# EAGLE schematic Schematic (EAGLE 9.6.2)
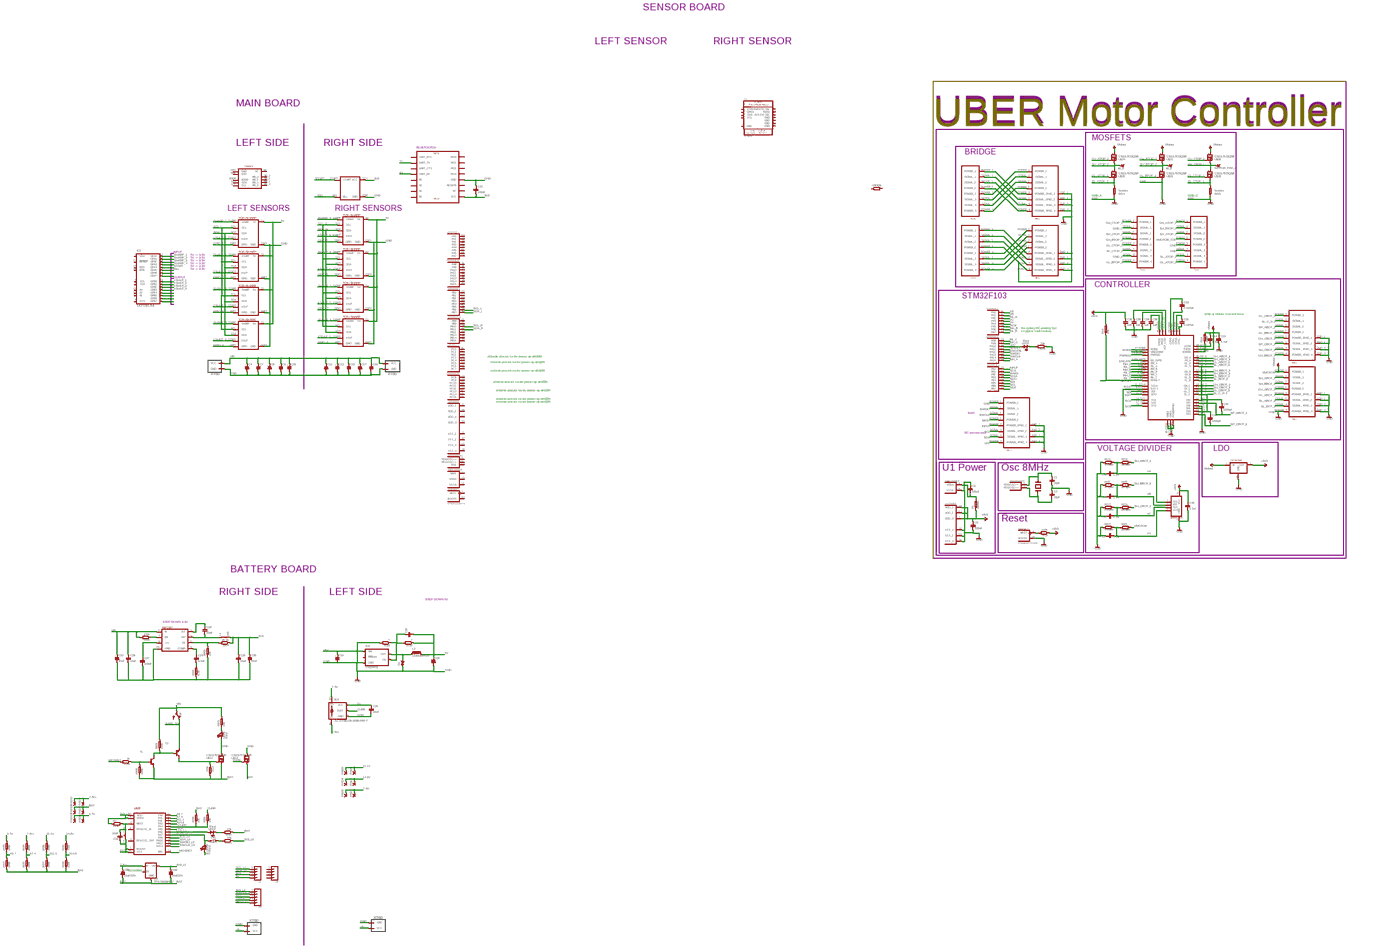
[diagram p0: schematic, sheet 1, overview]
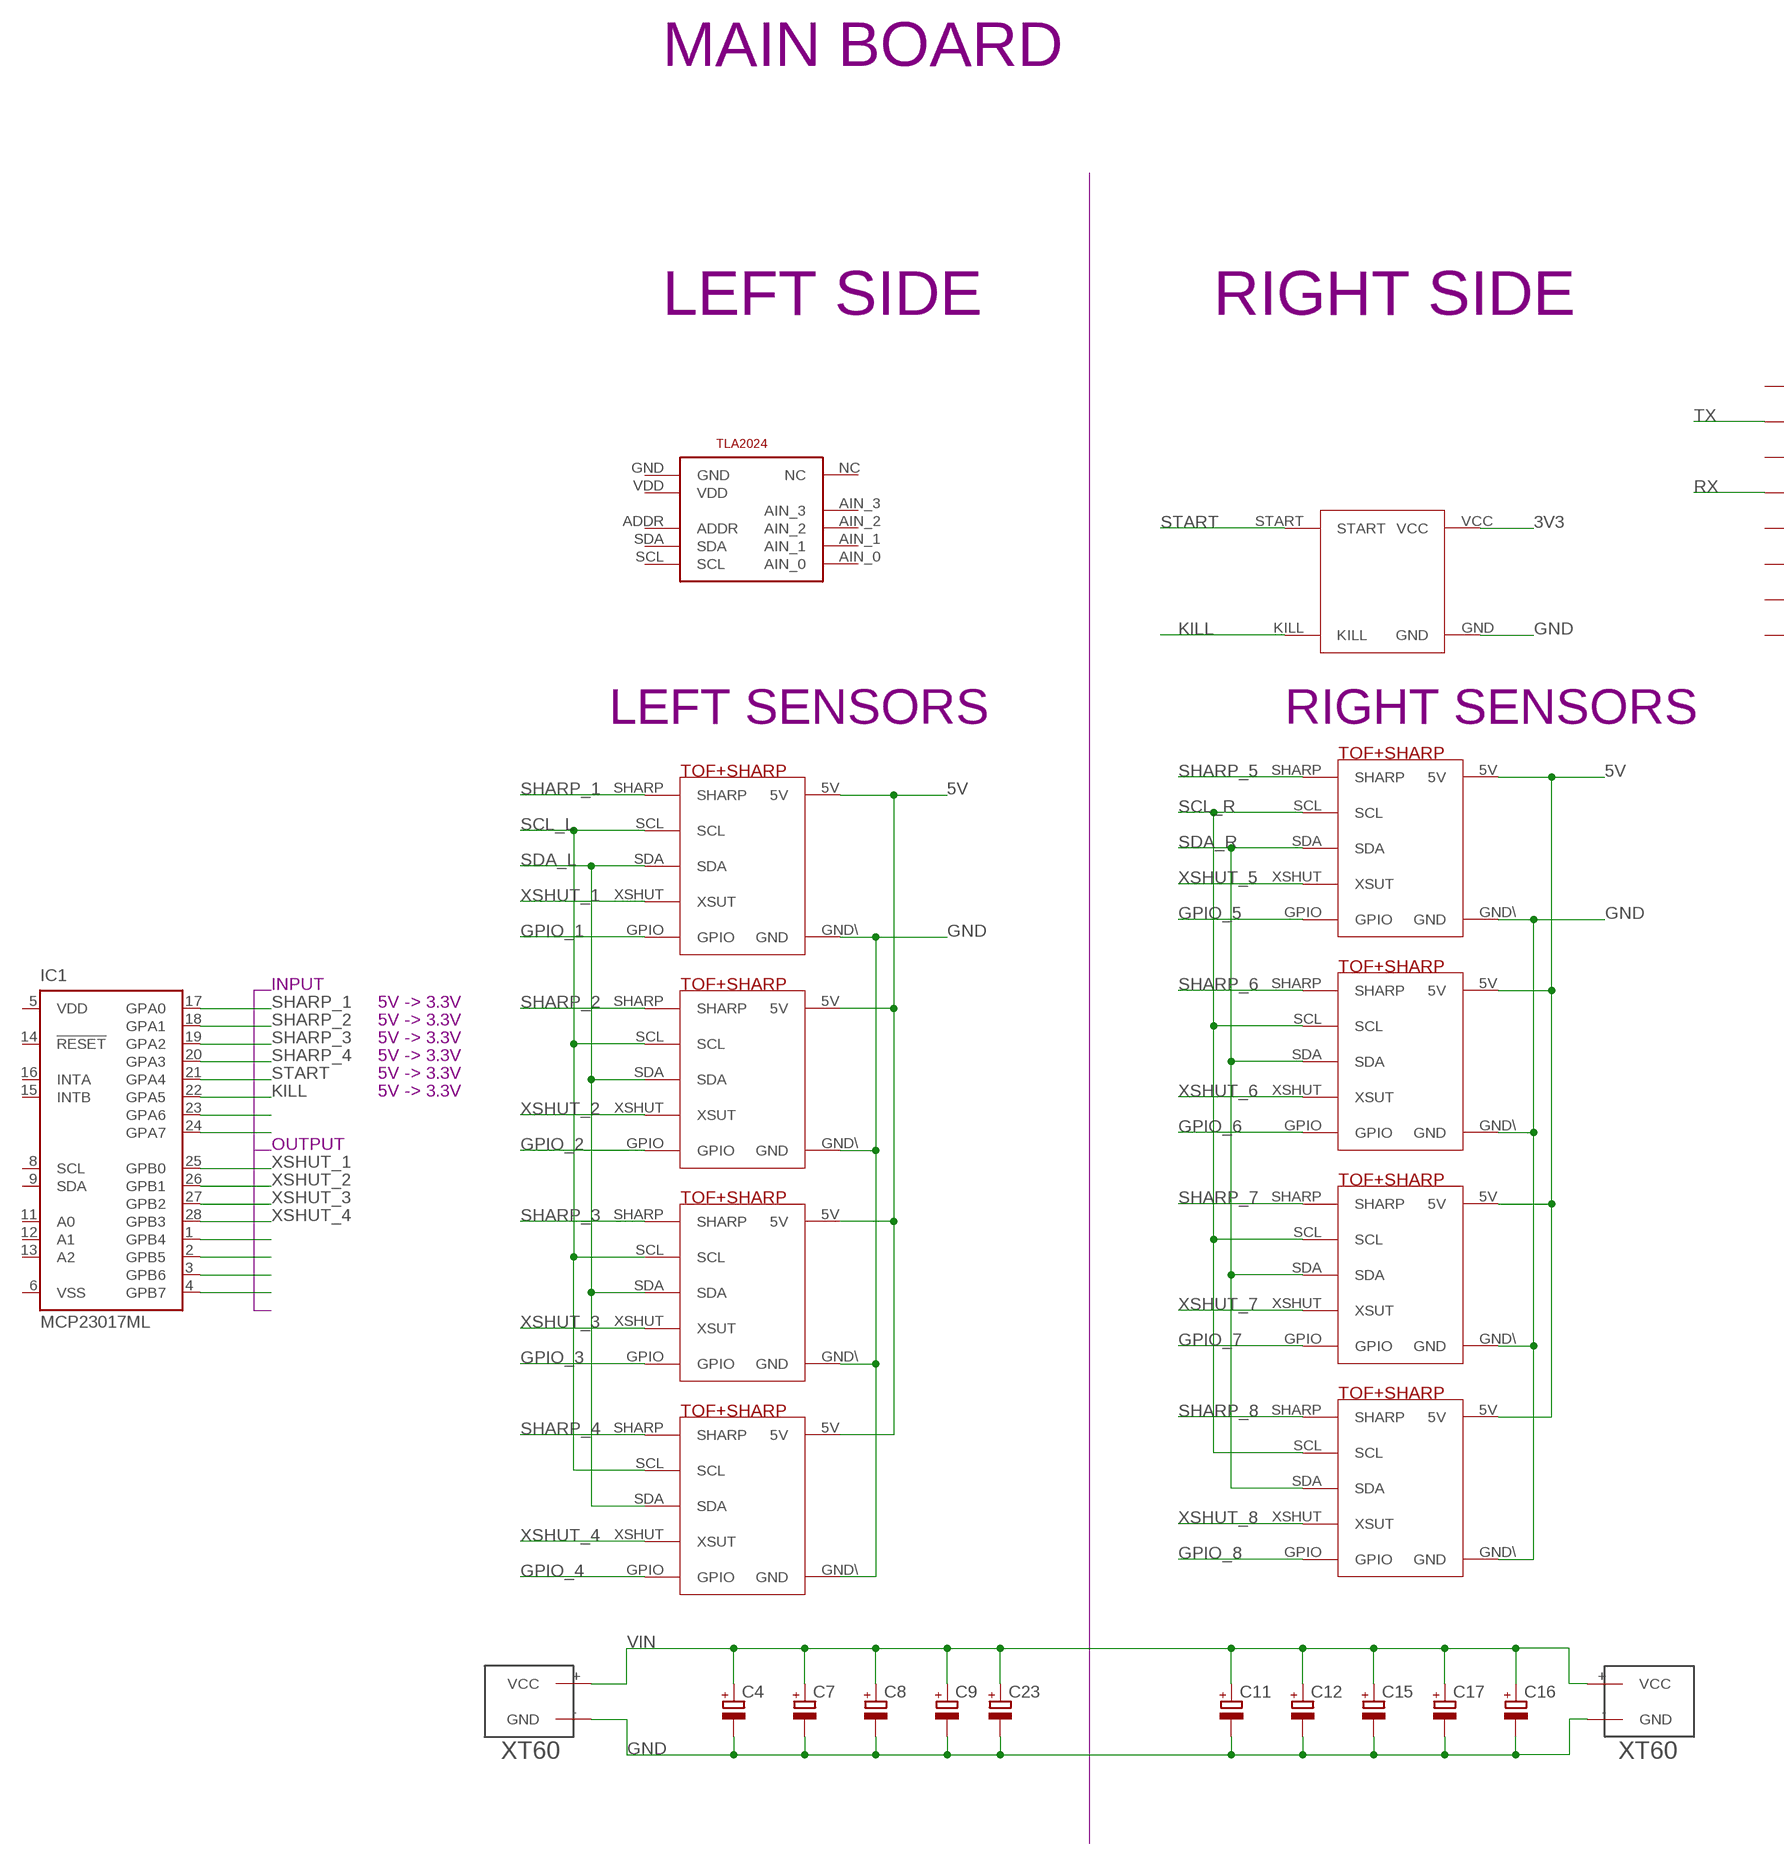
[diagram p1: schematic, sheet 1, part 1 of 5]
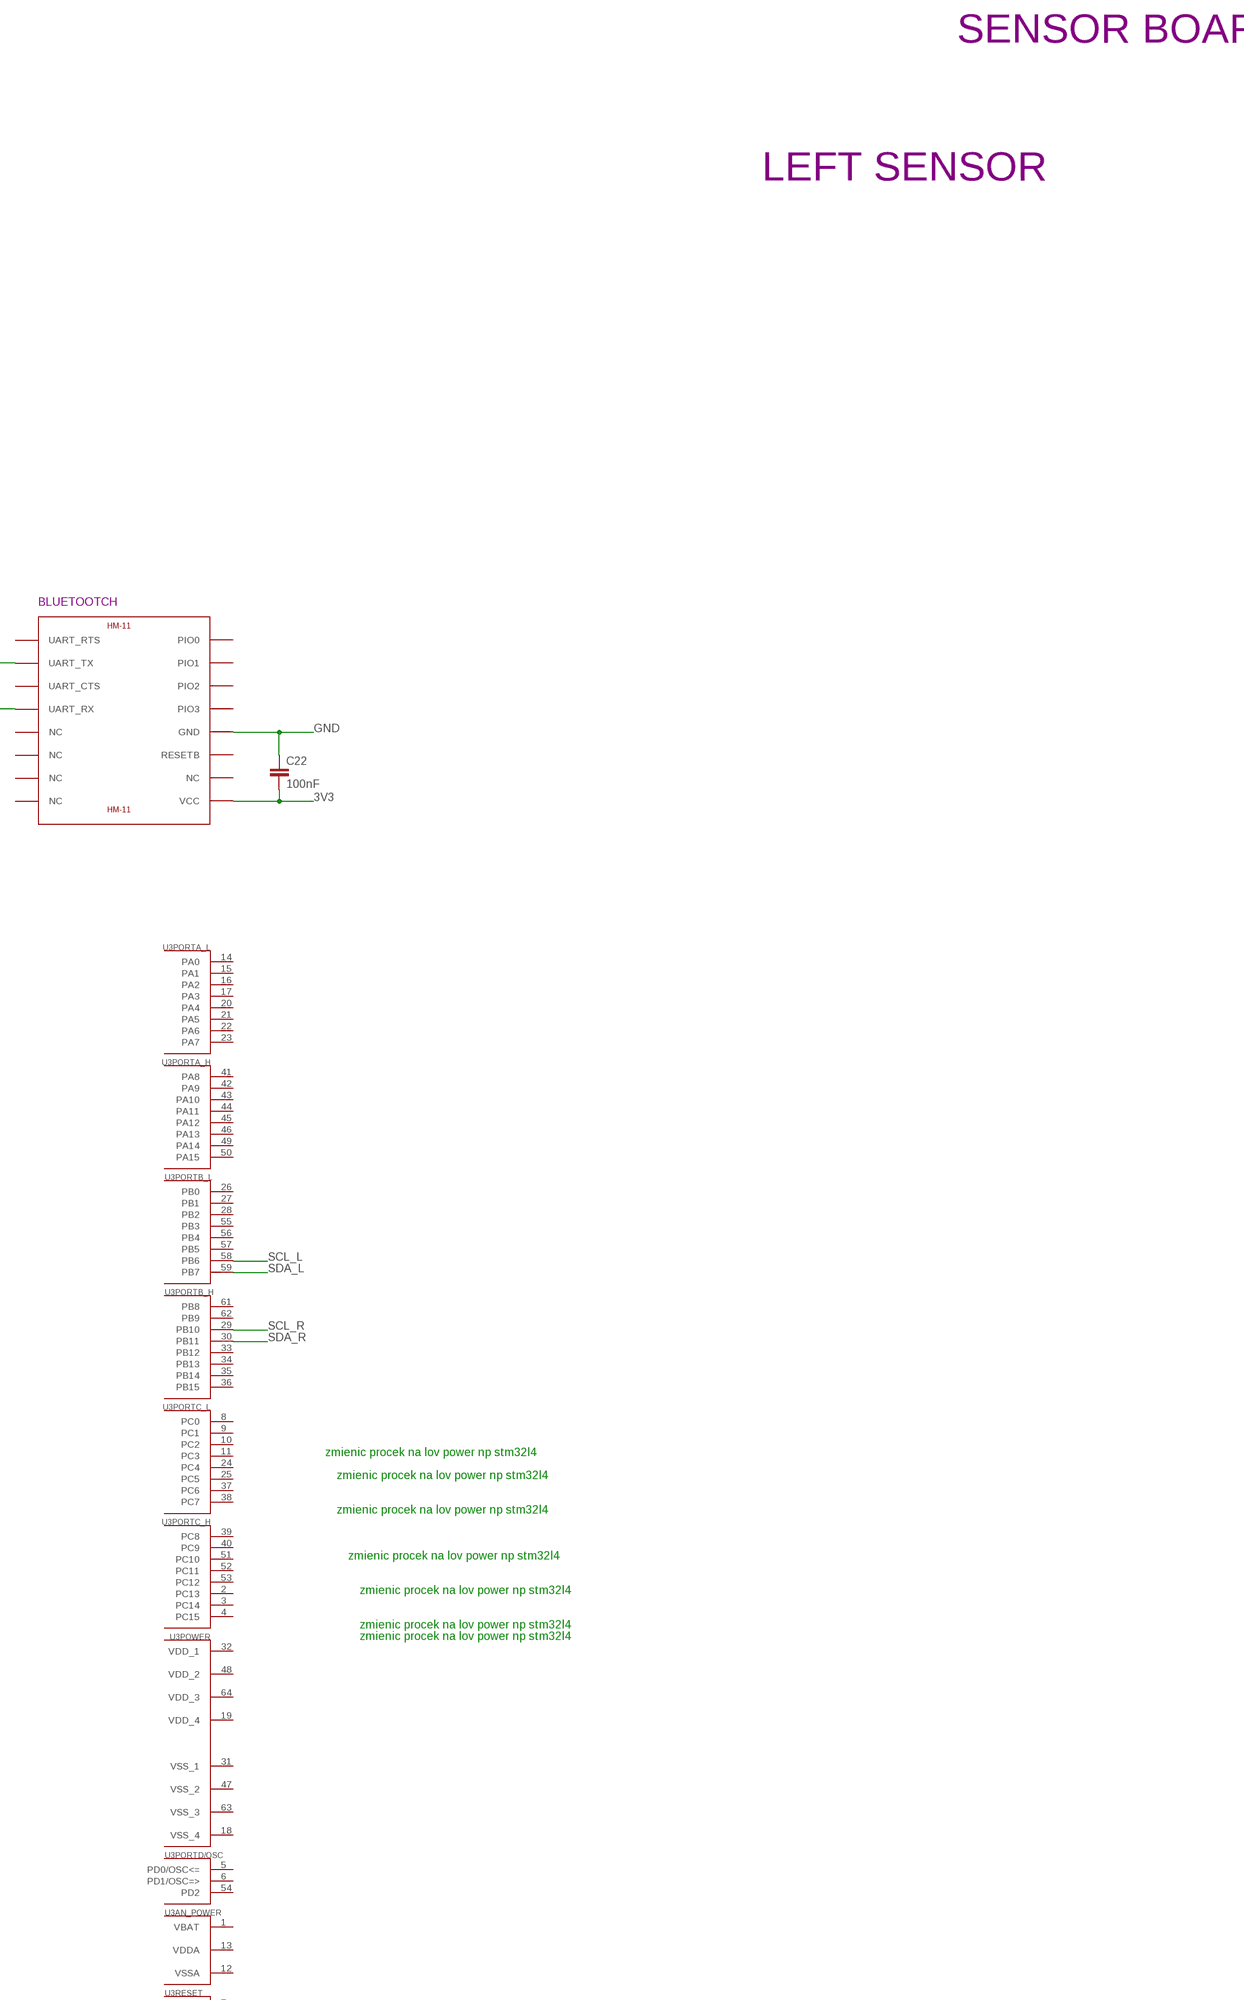
[diagram p2: schematic, sheet 1, part 2 of 5]
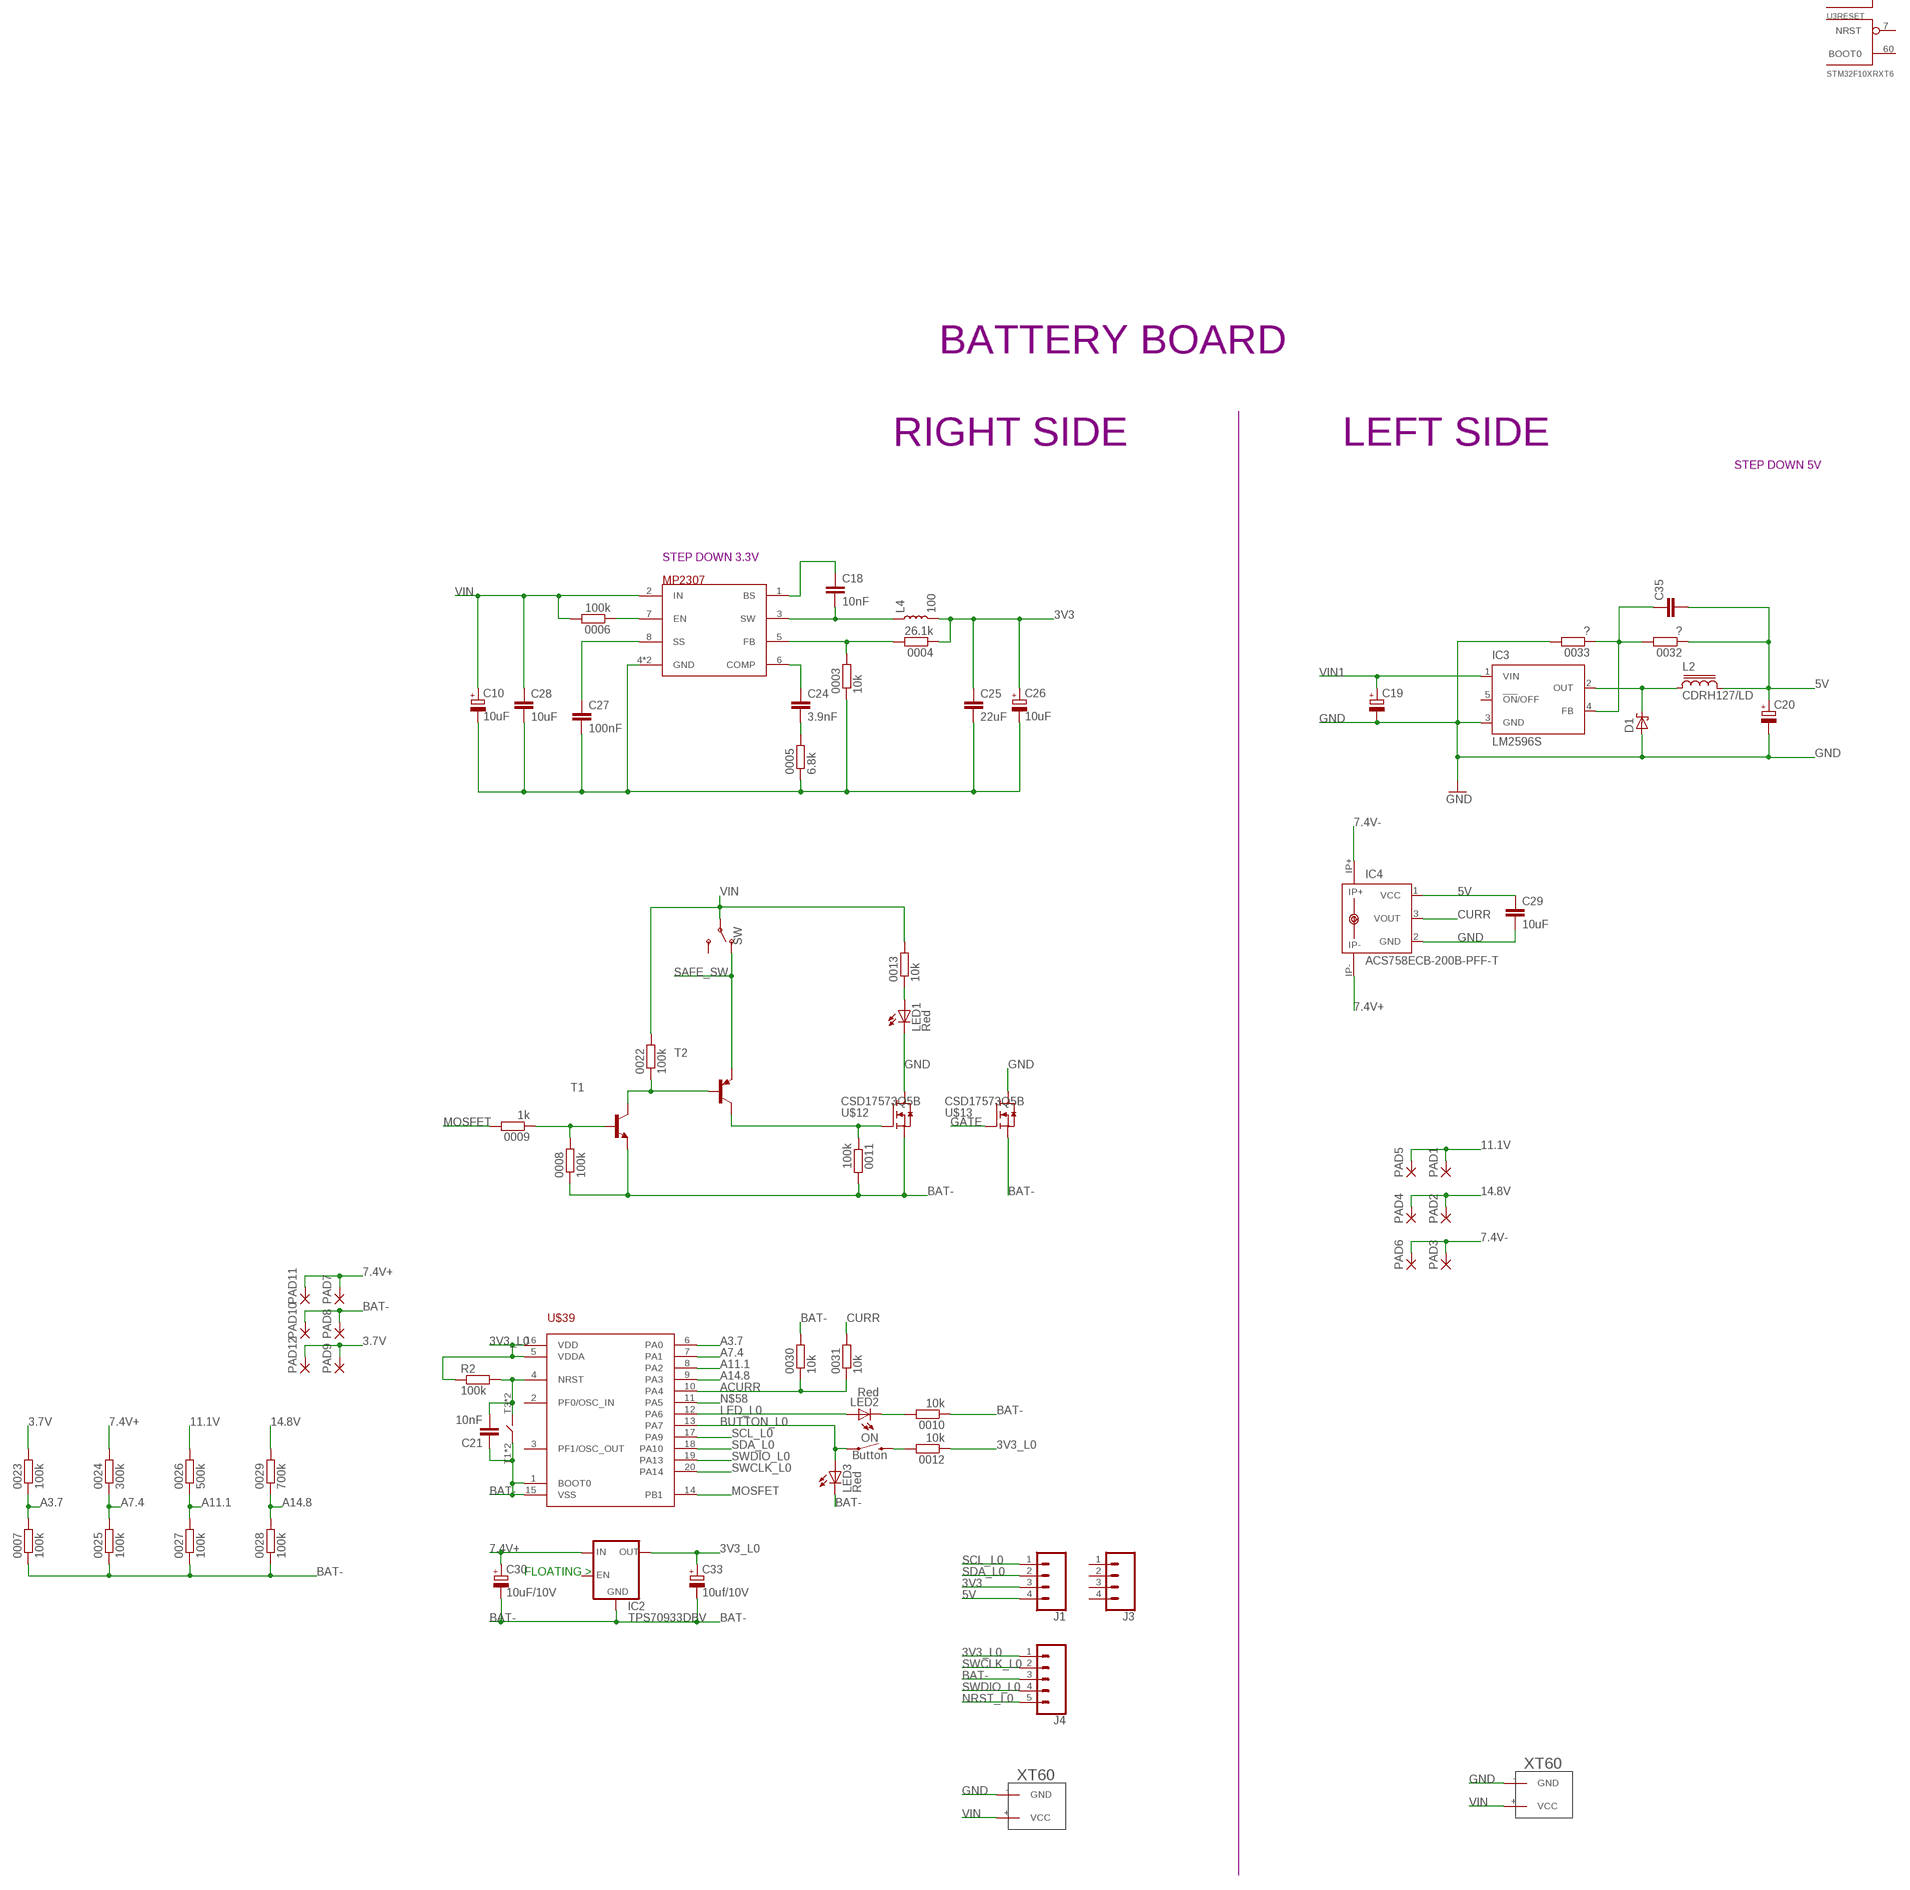
[diagram p3: schematic, sheet 1, part 3 of 5]
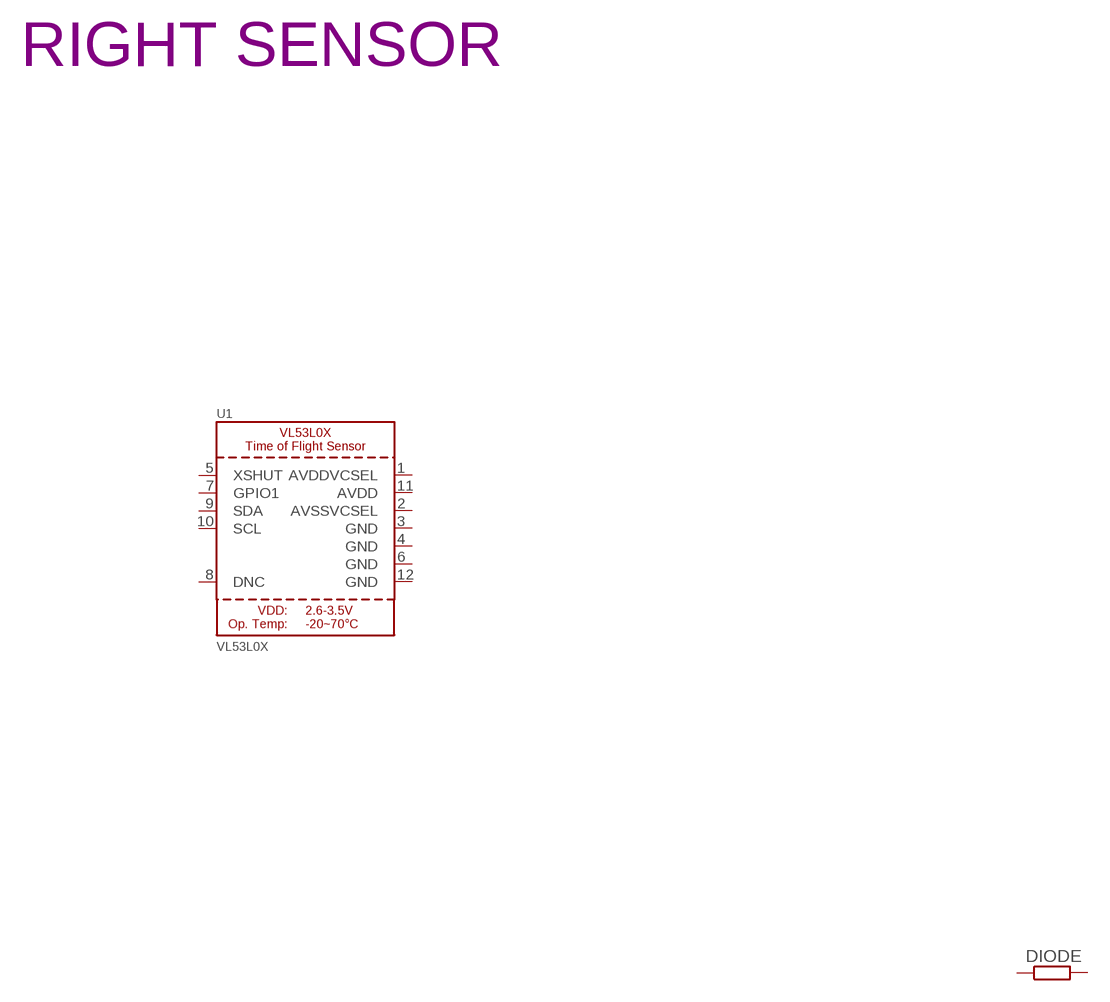
[diagram p4: schematic, sheet 1, part 4 of 5]
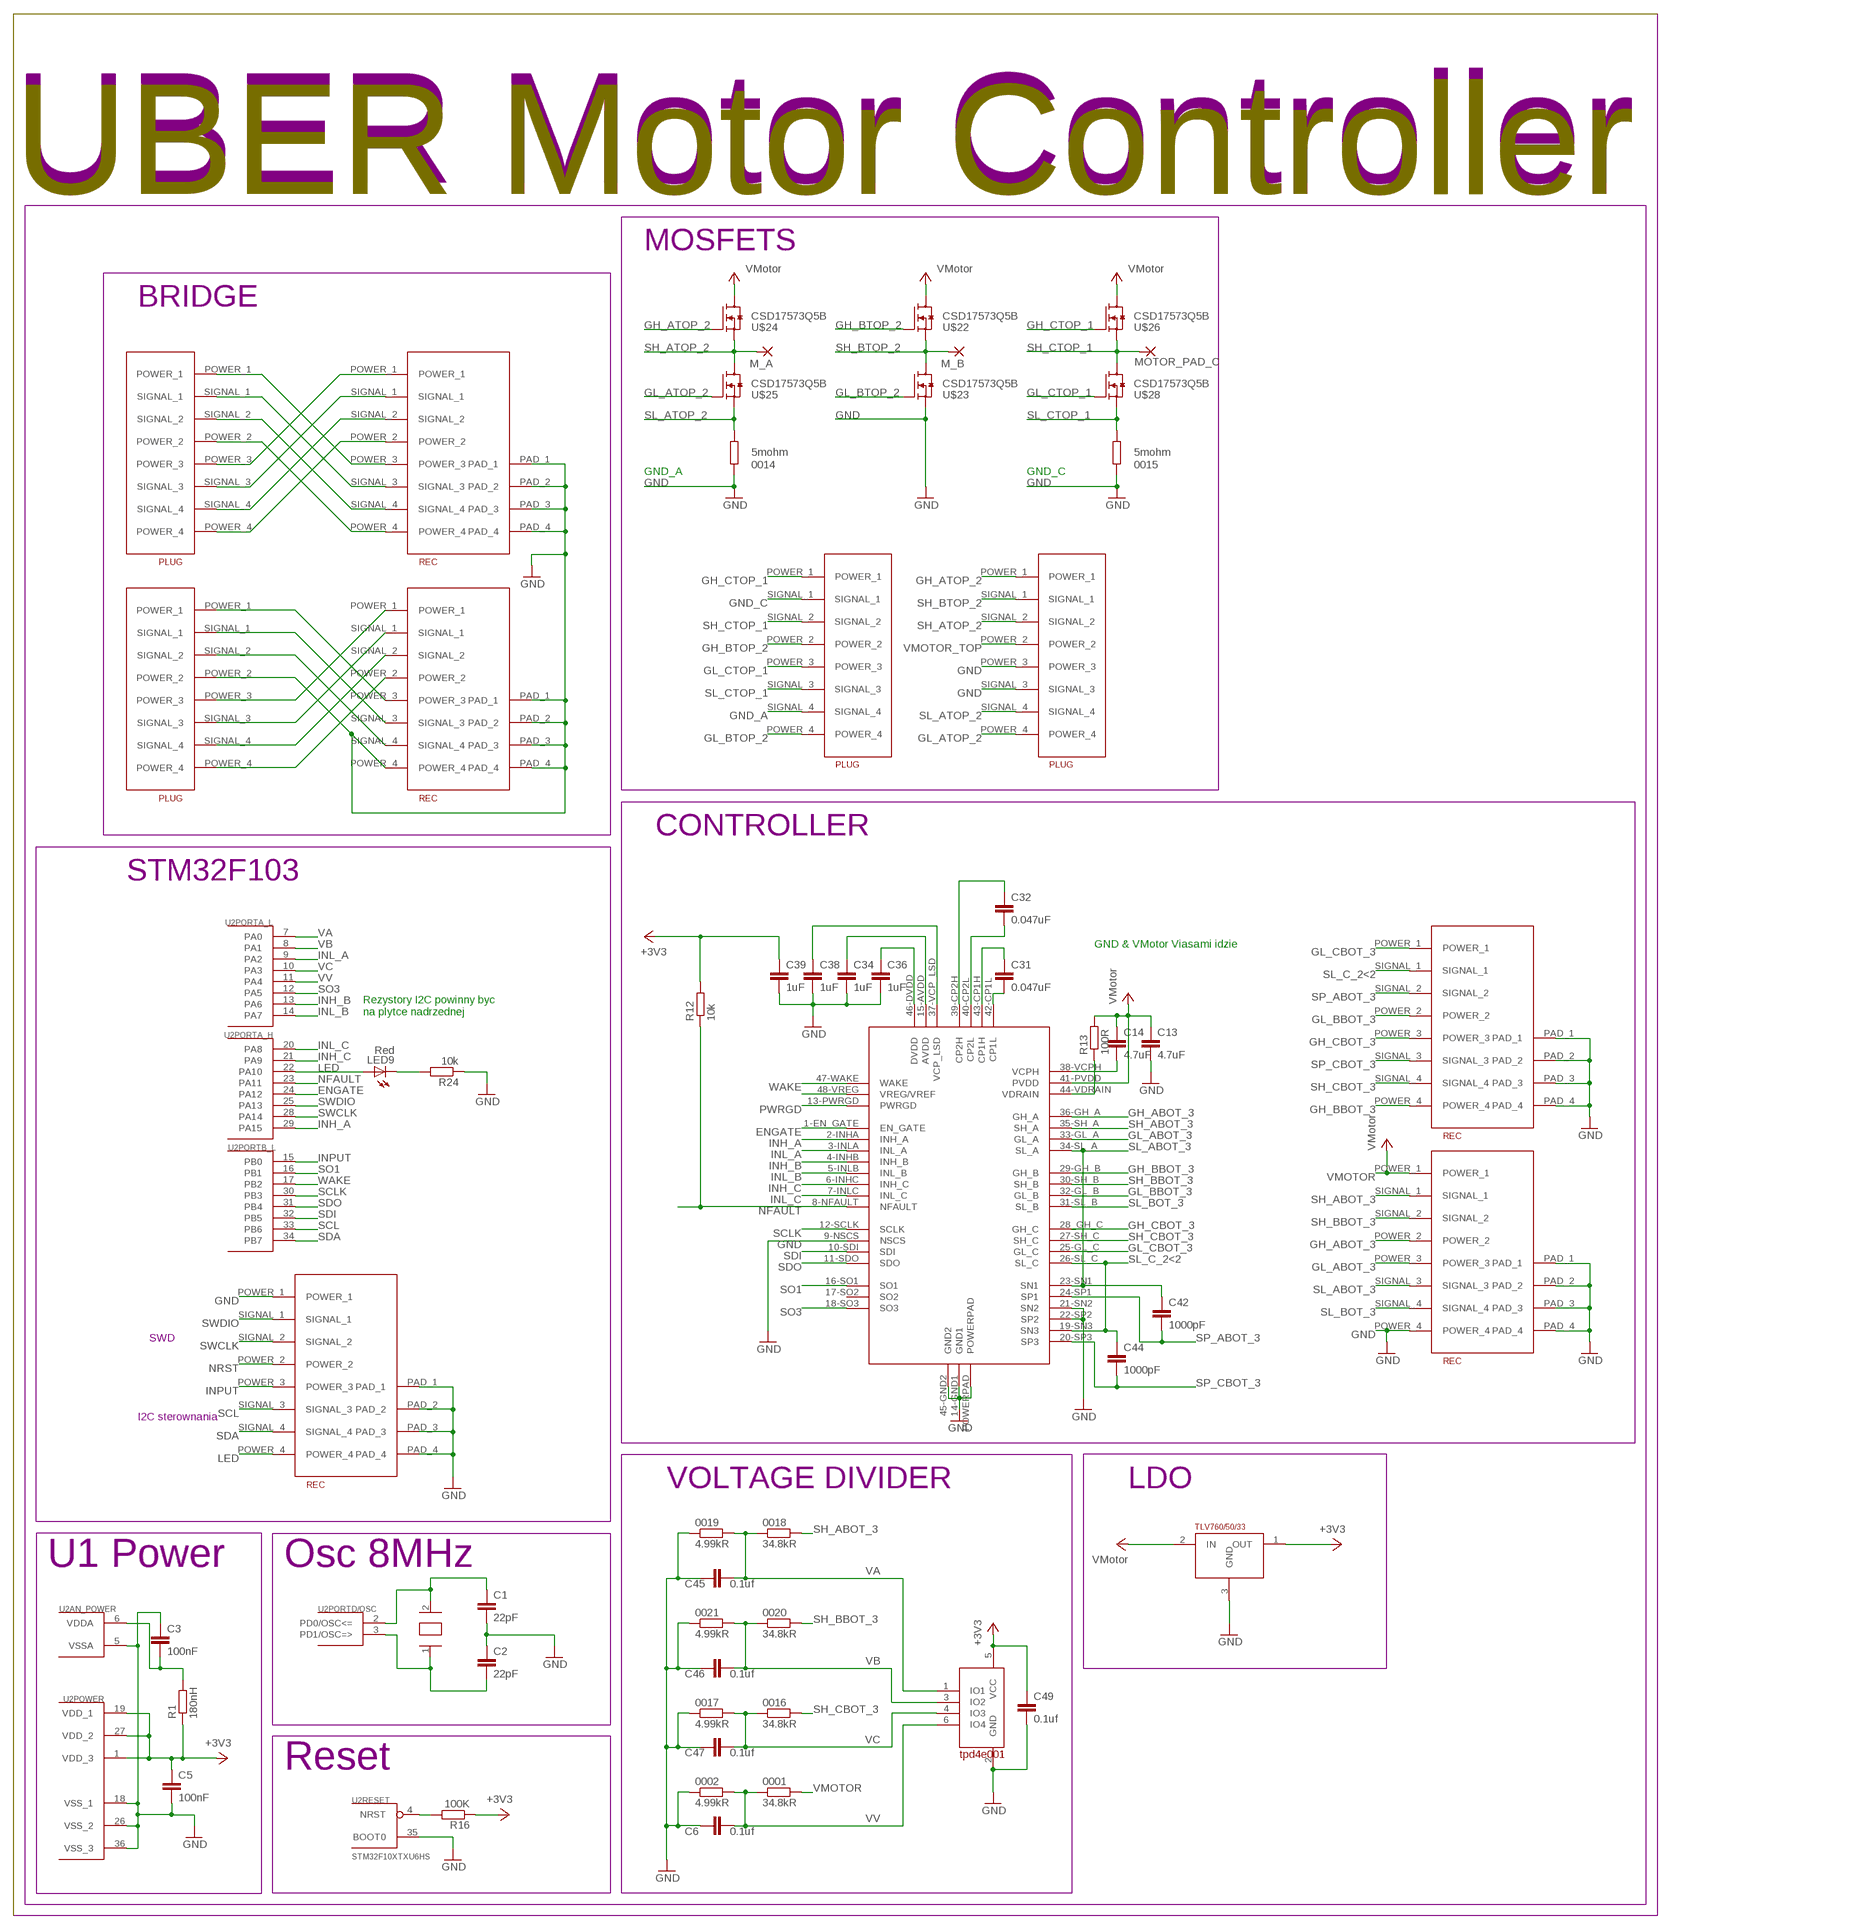
[diagram p5: schematic, sheet 1, part 5 of 5]

## Parts
0001  34.8kR  R-EU_R0603  [R0603]
0002  4.99kR  R-EU_R0603  [R0603]
0003  10k  R-EU_R0603  [R0603]
0004  26.1k  R-EU_R0603  [R0603]
0005  6.8k  R-EU_R0603  [R0603]
0006  100k  R-EU_R0603  [R0603]
0007  100k  R-EU_R0603  [R0603]
0008  100k  R-EU_R0603  [R0603]
0009  1k  R-EU_R0603  [R0603]
0010  10k  R-EU_R0603  [R0603]
0011  100k  R-EU_R0603  [R0603]
0012  10k  R-EU_R0603  [R0603]
0013  10k  R-EU_R0603  [R0603]
0014  5mohm  R-EU_R2512  [R2512]
0015  5mohm  R-EU_R2512  [R2512]
0016  34.8kR  R-EU_R0603  [R0603]
0017  4.99kR  R-EU_R0603  [R0603]
0018  34.8kR  R-EU_R0603  [R0603]
0019  4.99kR  R-EU_R0603  [R0603]
0020  34.8kR  R-EU_R0603  [R0603]
0021  4.99kR  R-EU_R0603  [R0603]
0022  100k  R-EU_R0603  [R0603]
0023  100k  R-EU_R0603  [R0603]
0024  300k  R-EU_R0603  [R0603]
0025  100k  R-EU_R0603  [R0603]
0026  500k  R-EU_R0603  [R0603]
0027  100k  R-EU_R0603  [R0603]
0028  100k  R-EU_R0603  [R0603]
0029  700k  R-EU_R0603  [R0603]
0030  10k  R-EU_R0603  [R0603]
0031  10k  R-EU_R0603  [R0603]
0032  ?  R-EU_R0603  [R0603]
0033  ?  R-EU_R0603  [R0603]
C1  22pF  C-EUC0603  [C0603]
C2  22pF  C-EUC0603  [C0603]
C3  100nF  C-EUC0603  [C0603]
C4  CPOL-EU153CLV-0810  [153CLV-0810]
C5  100nF  C-EUC0603  [C0603]
C6  0.1uf  C-EUC0603  [C0603]
C7  CPOL-EU153CLV-0810  [153CLV-0810]
C8  CPOL-EU153CLV-0810  [153CLV-0810]
C9  CPOL-EU153CLV-0810  [153CLV-0810]
C10  10uF  CPOL-EU153CLV-0605  [153CLV-0605]
C11  CPOL-EU153CLV-0810  [153CLV-0810]
C12  CPOL-EU153CLV-0810  [153CLV-0810]
C13  4.7uF  C-EUC0805  [C0805]
C14  4.7uF  C-EUC0805  [C0805]
C15  CPOL-EU153CLV-0810  [153CLV-0810]
C16  CPOL-EU153CLV-0810  [153CLV-0810]
C17  CPOL-EU153CLV-0810  [153CLV-0810]
C18  10nF  C-EUC0603  [C0603]
C19  CPOL-EU153CLV-0810  [153CLV-0810]
C20  CPOL-EU153CLV-0810  [153CLV-0810]
C21  10nF  C-EUC0603  [C0603]
C22  100nF  C-EUC0603  [C0603]
C23  CPOL-EU153CLV-0810  [153CLV-0810]
C24  3.9nF  C-EUC0603  [C0603]
C25  22uF  C-EUC0805  [C0805]
C26  10uF  CPOL-EU153CLV-0605  [153CLV-0605]
C27  100nF  C-EUC0603  [C0603]
C28  10uF  C-EUC0805  [C0805]
C29  10uF  C-EUC0805  [C0805]
C30  10uF/10V  CPOL-EUSMCA  [SMC_A]
C31  0.047uF  C-EUC0603  [C0603]
C32  0.047uF  C-EUC0603  [C0603]
C33  10uf/10V  CPOL-EUSMCA  [SMC_A]
C34  1uF  C-EUC0603  [C0603]
C35  C-EUC0603  [C0603]
C36  1uF  C-EUC0603  [C0603]
C38  1uF  C-EUC0603  [C0603]
C39  1uF  C-EUC0603  [C0603]
C42  1000pF  C-EUC0603  [C0603]
C44  1000pF  C-EUC0603  [C0603]
C45  0.1uf  C-EUC0603  [C0603]
C46  0.1uf  C-EUC0603  [C0603]
C47  0.1uf  C-EUC0603  [C0603]
C49  0.1uf  C-EUC0603  [C0603]
D1  SCHOTTKY-DIODESMD  [SMB]
DIODE  R-EU_R0805  [R0805]
IC1  MCP23017ML  [QFN28-ML_6X6MM]
IC2  TPS70933DBV  [SOT23-5]
IC3  LM2596S  [TO263-5]
IC4  ACS758ECB-200B-PFF-T  [CB-PFF]
J1  CONN_04  [1X04]
J3  CONN_04  [1X04]
J4  CONN_05  [1X05]
L2  CDRH127/LD  [CDRH127/LD]
L4  100  INDUCTOR-SRN6045-33UH  [SRN6045]
LED1  Red  LEDSML0603  [SML0603]
LED2  Red  LEDSML0603  [SML0603]
LED3  Red  LEDSML0603  [SML0603]
LED9  Red  LEDSML0603  [SML0603]
M_A  SMD5  [SMD2,54-5,08]
M_B  SMD5  [SMD2,54-5,08]
MOTOR_PAD_C  SMD5  [SMD2,54-5,08]
ON  Button  MOMENTARY-SWITCH-SPST-SMD-RIGHT-ANGLE  [TACTILE_SWITCH_SMD_RIGHT_ANGLE]
PAD1  SMD5  [SMD2,54-5,08]
PAD2  SMD5  [SMD2,54-5,08]
PAD3  SMD5  [SMD2,54-5,08]
PAD4  SMD5  [SMD2,54-5,08]
PAD5  SMD5  [SMD2,54-5,08]
PAD6  SMD5  [SMD2,54-5,08]
PAD7  SMD5  [SMD2,54-5,08]
PAD8  SMD5  [SMD2,54-5,08]
PAD9  SMD5  [SMD2,54-5,08]
PAD10  SMD5  [SMD2,54-5,08]
PAD11  SMD5  [SMD2,54-5,08]
PAD12  SMD5  [SMD2,54-5,08]
R1  180nH  R-EU_R0603  [R0603]
R2  100k  R-EU_R0603  [R0603]
R12  10k  R-EU_R0603  [R0603]
R13  100R  R-EU_R0603  [R0603]
R16  100K  R-EU_R0603  [R0603]
R24  10k  R-EU_R0603  [R0603]
SW  SWITCH-SPDT-SMD-RIGHT-ANGLE  [SWITCH_SPST_SMD_A]
T1  BC817-25-NPN-SOT23-BEC  [SOT23-BEC]
T2  BC807-40-PNP-SOT23-BEC  [SOT23-BEC]
U1  VL53L0X  [LGA12_ST]
U2  STM32F10XTXU6HS  [VFQFPN36-HS]
U3  STM32F10XRXT6  [TQFP64]
U$1  MOLEG_REC_8X0.4MM  [REC]
U$2  MOLEG_REC_8X0.4MM  [REC]
U$3  MOLEX_PLUG_8X0.4MM  [PLUG]
U$4  MOLEG_REC_8X0.4MM  [REC]
U$5  MOLEG_REC_8X0.4MM  [REC]
U$6  MOLEX_PLUG_8X0.4MM  [PLUG]
U$7  MOLEX_PLUG_8X0.4MM  [PLUG]
U$8  MOLEX_PLUG_8X0.4MM  [PLUG]
U$9  MOLEG_REC_8X0.4MM  [REC]
U$10  OSC_8MHZ  [SMD_MINI]
U$11  TLV760XX  [SOT-23-3]
U$12  CSD17573Q5B  [Q5B]
U$13  CSD17573Q5B  [Q5B]
U$14  TOF+SHARP  [TOF+SHARP_V1]
U$15  TOF+SHARP  [TOF+SHARP_V1]
U$16  TOF+SHARP  [TOF+SHARP_V1]
U$17  XT60  [XT60]
U$18  TOF+SHARP  [TOF+SHARP_V1]
U$19  TOF-SHARP  [TOF+SHARP_V2]
U$20  TOF-SHARP  [TOF+SHARP_V2]
U$21  DRV8305  [S-PQFP-G48]
U$22  CSD17573Q5B  [Q5B]
U$23  CSD17573Q5B  [Q5B]
U$24  CSD17573Q5B  [Q5B]
U$25  CSD17573Q5B  [Q5B]
U$26  CSD17573Q5B  [Q5B]
U$27  TOF-SHARP  [TOF+SHARP_V2]
U$28  CSD17573Q5B  [Q5B]
U$29  TOF-SHARP  [TOF+SHARP_V2]
U$30  SUPER_DUPER_GUZICZEK  [SUPER_DUPER_GUZICZEK]
U$31  TPD4E001  [SOT-23]
U$32  IR_SW  [IR_SW]
U$33  TLA2024  [X2QFN]
U$34  HM-11  [HM-11]
U$35  MP2307  [SOIC8N]
U$36  XT60  [XT60]
U$37  XT60  [XT60]
U$38  XT60  [XT60]
U$39  STM32F030F4  [TSSOP20]

## Nets
3.7V: 0023.2 PAD9.1(P) PAD12.1(P)
3V3: 0004.1 C22.2 C25.1 C26.+ J1.3 L4.2 U$32.VCC U$34.VCC
3V3_L0: 0012.1 C33.+ IC2.5(OUT) J4.1 R2.1 U$39.5(VDDA) U$39.16(VDD)
5V: 0032.1 C20.+ C29.1 C35.2 IC4.1(VCC) J1.4 L2.2 U$14.5V U$15.5V U$16.5V U$18.5V U$19.5V U$20.5V U$27.5V U$29.5V
7.4V+: 0024.2 C30.+ IC2.1(IN) IC4.IP- PAD7.1(P) PAD11.1(P)
7.4V-: IC4.IP+ PAD3.1(P) PAD6.1(P)
11.1V: 0026.2 PAD1.1(P) PAD5.1(P)
14.8V: 0029.2 PAD2.1(P) PAD4.1(P)
+3V3: C5.1 C39.1 C49.1 R1.1 R12.2 R16.1 U2.1(POWER:VDD_3) U2.19(POWER:VDD_1) U2.27(POWER:VDD_2) U$11.1(OUT) U$31.5(VCC)
A3.7: 0007.2 0023.1 U$39.6(PA0)
A7.4: 0024.1 0025.2 U$39.7(PA1)
A11.1: 0026.1 0027.2 U$39.8(PA2)
A14.8: 0028.2 0029.1 U$39.9(PA3)
ACURR: 0030.1 0031.1 U$39.10(PA4)
BAT-: 0007.1 0008.1 0010.1 0011.2 0025.1 0027.1 0028.1 0030.2 C21.1 C30.- C33.- IC2.2(GND) J4.3 LED3.C PAD8.1(P) PAD10.1(P) T1.E U$12.S1(S) U$12.S2(S) U$12.S3(S) U$13.S1(S) U$13.S2(S) U$13.S3(S) U$30.T1(T2) U$30.T2 U$39.1(BOOT0) U$39.15(VSS)
BS: C18.1 U$35.1(BS)
BUTTON_L0: LED3.A ON.1 U$39.13(PA7)
COMP: C24.1 U$35.6(COMP)
CURR: 0031.2 IC4.3(VOUT)
EN: 0006.1 U$35.7(EN)
ENGATE: U2.24(PORTA_H:PA12) U$21.1-EN_GATE(EN_GATE)
FB: 0003.2 0004.2 U$35.5(FB)
GATE: U$13.G
GH_ABOT_3: U$9.POWER_2 U$21.36-GH_A(GH_A)
GH_ATOP_2: U$3.POWER_1 U$24.G
GH_BBOT_3: U$4.POWER_4 U$21.29-GH_B(GH_B)
GH_BTOP_2: U$6.POWER_2 U$22.G
GH_CBOT_3: U$4.POWER_3 U$21.28_GH_C(GH_C)
GH_CTOP_1: U$6.POWER_1 U$26.G
GL_ABOT_3: U$9.POWER_3 U$21.33-GL_A(GL_A)
GL_ATOP_2: U$3.POWER_4 U$25.G
GL_BBOT_3: U$4.POWER_2 U$21.32-GL_B(GL_B)
GL_BTOP_2: U$6.POWER_4 U$23.G
GL_CBOT_3: U$4.POWER_1 U$21.25-GL_C(GL_C)
GL_CTOP_1: U$6.POWER_3 U$28.G
GND: 0002.1 0003.1 0005.1 0014.1 0015.1 0017.1 0019.1 0021.1 0033.2 C1.2 C2.1 C3.1 C4.- C5.2 C6.2 C7.- C8.- C9.- C10.- C11.- C12.- C13.2 C15.- C16.- C17.- C19.- C20.- C22.1 C23.- C25.2 C26.- C27.2 C28.2 C29.2 C34.2 C36.2 C38.2 C39.2 C45.2 C46.2 C47.2 C49.2 D1.A IC3.3(GND) IC4.2(GND) LED1.C R24.1 U2.5(AN_POWER:VSSA) U2.18(POWER:VSS_1) U2.26(POWER:VSS_2) U2.35(RESET:BOOT0) U2.36(POWER:VSS_3) U$1.PAD_1 U$1.PAD_2 U$1.PAD_3 U$1.PAD_4 U$2.PAD_1 U$2.PAD_2 U$2.PAD_3 U$2.PAD_4 U$2.POWER_1 U$3.POWER_3 U$3.SIGNAL_3 U$4.PAD_1 U$4.PAD_2 U$4.PAD_3 U$4.PAD_4 U$5.PAD_1 U$5.PAD_2 U$5.PAD_3 U$5.PAD_4 U$5.POWER_4 U$8.POWER_2 U$9.PAD_1 U$9.PAD_2 U$9.PAD_3 U$9.PAD_4 U$9.POWER_4 U$11.3(GND) U$12.D1(D) U$12.D2(D) U$12.D3(D) U$12.D4(D) U$12.D5(D) U$13.D1(D) U$13.D2(D) U$13.D3(D) U$13.D4(D) U$13.D5(D) U$14.GND\(GND) U$15.GND\(GND) U$16.GND\(GND) U$17.-(GND) U$18.GND\(GND) U$19.GND\(GND) U$20.GND\(GND) U$21.9-NSCS(NSCS) U$21.14-GND1(GND1) U$21.21-SN2(SN2) U$21.22-SP2(SP2) U$21.45-GND2(GND2) U$21.POWERPAD U$23.S1(S) U$23.S2(S) U$23.S3(S) U$27.GND\(GND) U$29.GND\(GND) U$31.2(GND) U$32.GND U$34.GND U$35.4(GND) U$35.PAD(GND) U$36.-(GND) U$37.-(GND) U$38.-(GND)
GND_A: U$6.SIGNAL_4
GND_C: U$6.SIGNAL_1
GPIO_1: U$14.GPIO
GPIO_2: U$15.GPIO
GPIO_3: U$16.GPIO
GPIO_4: U$18.GPIO
GPIO_5: U$19.GPIO
GPIO_6: U$20.GPIO
GPIO_7: U$27.GPIO
GPIO_8: U$29.GPIO
INH_A: U2.29(PORTA_H:PA15) U$21.2-INHA(INH_A)
INH_B: U2.13(PORTA_L:PA6) U$21.4-INHB(INH_B)
INH_C: U2.21(PORTA_H:PA9) U$21.6-INHC(INH_C)
INL_A: U2.9(PORTA_L:PA2) U$21.3-INLA(INL_A)
INL_B: U2.14(PORTA_L:PA7) U$21.5-INLB(INL_B)
INL_C: U2.20(PORTA_H:PA8) U$21.7-INLC(INL_C)
INPUT: U2.15(PORTB_L:PB0) U$2.POWER_3
KILL: IC1.22(GPA5) U$32.KILL
LED: LED9.A U2.22(PORTA_H:PA10) U$2.POWER_4
LED_L0: LED2.A U$39.12(PA6)
MOSFET: 0009.2 U$39.14(PB1)
N$1: 0032.2 0033.1 C35.1 IC3.4(FB)
N$2: U$21.48-VREG(VREG/VREF)
N$3: U$5.POWER_3 U$8.POWER_1
N$4: U$5.SIGNAL_3 U$8.SIGNAL_1
N$5: U$5.SIGNAL_4 U$8.SIGNAL_2
N$6: 0008.2 0009.1 T1.B
N$7: U$1.POWER_3 U$7.POWER_1
N$8: U$1.SIGNAL_3 U$7.SIGNAL_1
N$9: U$1.SIGNAL_4 U$7.SIGNAL_2
N$10: C36.1 U$21.46-DVDD(DVDD)
N$11: U$1.POWER_4 U$7.POWER_2
N$12: C34.1 U$21.15-AVDD(AVDD)
N$13: C38.1 U$21.37-VCP_LSD(VCP_LSD)
N$14: C31.2 U$21.42-CP1L(CP1L)
N$15: U$5.POWER_1 U$8.POWER_3
N$16: C31.1 U$21.43-CP1H(CP1H)
N$17: U$5.SIGNAL_1 U$8.SIGNAL_3
N$18: U$5.SIGNAL_2 U$8.SIGNAL_4
N$19: U$5.POWER_2 U$8.POWER_4
N$20: C32.2 U$21.40-CP2L(CP2L)
N$21: C32.1 U$21.39-CP2H(CP2H)
N$22: R13.1 U$21.44-VDRAIN(VDRAIN)
N$23: C14.2 U$21.38-VCPH(VCPH)
N$24: C1.1 U2.2(PORTD/OSC:PD0/OSC<=) U$10.2
N$25: U$1.POWER_1 U$7.POWER_3
N$26: U$1.SIGNAL_1 U$7.SIGNAL_3
N$27: U$1.SIGNAL_2 U$7.SIGNAL_4
N$28: U$1.POWER_2 U$7.POWER_4
N$29: 0022.1 T1.C T2.B
N$34: 0005.2 C24.2
N$40: IC1.2(GPB5)
N$41: IC1.3(GPB6)
N$42: IC1.4(GPB7)
N$44: IC1.23(GPA6)
N$45: C3.2 R1.2 U2.6(AN_POWER:VDDA)
N$46: IC1.24(GPA7)
N$52: 0010.2 LED2.C
N$53: C2.2 U2.3(PORTD/OSC:PD1/OSC=>) U$10.1
N$54: 0012.2 ON.2
N$58: U$39.11(PA5)
N$81: LED9.C R24.2
N$87: 0013.1 LED1.A
N$89: 0011.1 T2.C U$12.G
NFAULT: R12.1 U2.23(PORTA_H:PA11) U$21.8-NFAULT(NFAULT)
NRST: R16.2 U2.4(RESET:NRST) U$2.POWER_2
NRST_L0: C21.2 J4.5 R2.2 U$30.T3(T4) U$30.T4 U$39.4(NRST)
OUT: D1.C IC3.2(OUT) L2.1
PWRGD: U$21.13-PWRGD(PWRGD)
RX: U$34.UART_RX
SAFE_SW: SW.1(O) T2.E
SCL: U2.33(PORTB_L:PB6) U$2.SIGNAL_3
SCL_L: U3.58(PORTB_L:PB6) U$14.SCL U$15.SCL U$16.SCL U$18.SCL
SCL_L0: J1.1 U$39.17(PA9)
SCL_R: U3.29(PORTB_H:PB10) U$19.SCL U$20.SCL U$27.SCL U$29.SCL
SCLK: U2.30(PORTB_L:PB3) U$21.12-SCLK(SCLK)
SDA: U2.34(PORTB_L:PB7) U$2.SIGNAL_4
SDA_L: U3.59(PORTB_L:PB7) U$14.SDA U$15.SDA U$16.SDA U$18.SDA
SDA_L0: J1.2 U$39.18(PA10)
SDA_R: U3.30(PORTB_H:PB11) U$19.SDA U$20.SDA U$27.SDA U$29.SDA
SDI: U2.32(PORTB_L:PB5) U$21.10-SDI(SDI)
SDO: U2.31(PORTB_L:PB4) U$21.11-SDO(SDO)
SH_ABOT_3: 0018.2 U$9.SIGNAL_1 U$21.35-SH_A(SH_A)
SH_ATOP_2: M_A.1(P) U$3.SIGNAL_2 U$24.S1(S) U$24.S2(S) U$24.S3(S) U$25.D1(D) U$25.D2(D) U$25.D3(D) U$25.D4(D) U$25.D5(D)
SH_BBOT_3: 0020.2 U$9.SIGNAL_2 U$21.30-SH_B(SH_B)
SH_BTOP_2: M_B.1(P) U$3.SIGNAL_1 U$22.S1(S) U$22.S2(S) U$22.S3(S) U$23.D1(D) U$23.D2(D) U$23.D3(D) U$23.D4(D) U$23.D5(D)
SH_CBOT_3: 0016.2 U$4.SIGNAL_4 U$21.27-SH_C(SH_C)
SH_CTOP_1: MOTOR_PAD_C.1(P) U$6.SIGNAL_2 U$26.S1(S) U$26.S2(S) U$26.S3(S) U$28.D1(D) U$28.D2(D) U$28.D3(D) U$28.D4(D) U$28.D5(D)
SHARP_1: IC1.17(GPA0) U$14.SHARP
SHARP_2: IC1.18(GPA1) U$15.SHARP
SHARP_3: IC1.19(GPA2) U$16.SHARP
SHARP_4: IC1.20(GPA3) U$18.SHARP
SHARP_5: U$19.SHARP
SHARP_6: U$20.SHARP
SHARP_7: U$27.SHARP
SHARP_8: U$29.SHARP
SL_ABOT_3: C42.1 U$9.SIGNAL_3 U$21.23-SN1(SN1) U$21.34-SL_A(SL_A)
SL_ATOP_2: 0014.2 U$3.SIGNAL_4 U$25.S1(S) U$25.S2(S) U$25.S3(S)
SL_BOT_3: U$9.SIGNAL_4 U$21.31-SL_B(SL_B)
SL_C_2<2: C44.1 U$4.SIGNAL_1 U$21.19-SN3(SN3) U$21.26-SL_C(SL_C)
SL_CTOP_1: 0015.2 U$6.SIGNAL_3 U$28.S1(S) U$28.S2(S) U$28.S3(S)
SO1: U2.16(PORTB_L:PB1) U$21.16-SO1(SO1)
SO3: U2.12(PORTA_L:PA5) U$21.18-SO3(SO3)
SP_ABOT_3: C42.2 U$4.SIGNAL_2 U$21.24-SP1(SP1)
SP_CBOT_3: C44.2 U$4.SIGNAL_3 U$21.20-SP3(SP3)
SS: C27.1 U$35.8(SS)
START: IC1.21(GPA4) U$32.START
SW: C18.2 L4.1 U$35.3(SW)
SWCLK: U2.28(PORTA_H:PA14) U$2.SIGNAL_2
SWCLK_L0: J4.2 U$39.20(PA14)
SWDIO: U2.25(PORTA_H:PA13) U$2.SIGNAL_1
SWDIO_L0: J4.4 U$39.19(PA13)
TX: U$34.UART_TX
VA: 0018.1 0019.2 C45.1 U2.7(PORTA_L:PA0) U$31.1(IO1)
VB: 0020.1 0021.2 C46.1 U2.8(PORTA_L:PA1) U$31.3(IO2)
VC: 0016.1 0017.2 C47.1 U2.10(PORTA_L:PA3) U$31.4(IO3)
VIN: 0006.2 0013.2 0022.2 C4.+ C7.+ C8.+ C9.+ C10.+ C11.+ C12.+ C15.+ C16.+ C17.+ C23.+ C28.1 SW.2(P) U$17.+(VCC) U$35.2(IN) U$36.+(VCC) U$37.+(VCC) U$38.+(VCC)
VIN1: C19.+ IC3.1(VIN)
VMOTOR: 0001.2 C13.1 C14.1 R13.2 U$9.POWER_1 U$11.2(IN) U$21.41-PVDD(PVDD) ; supply symbol labelled VMotor
VMOTOR_TOP: U$3.POWER_2 U$22.D1(D) U$22.D2(D) U$22.D3(D) U$22.D4(D) U$22.D5(D) U$24.D1(D) U$24.D2(D) U$24.D3(D) U$24.D4(D) U$24.D5(D) U$26.D1(D) U$26.D2(D) U$26.D3(D) U$26.D4(D) U$26.D5(D) ; supply symbol labelled VMotor
VV: 0001.1 0002.2 C6.1 U2.11(PORTA_L:PA4) U$31.6(IO4)
WAKE: U2.17(PORTB_L:PB2) U$21.47-WAKE(WAKE)
XSHUT_1: IC1.25(GPB0) U$14.XSHUT(XSUT)
XSHUT_2: IC1.26(GPB1) U$15.XSHUT(XSUT)
XSHUT_3: IC1.27(GPB2) U$16.XSHUT(XSUT)
XSHUT_4: IC1.28(GPB3) U$18.XSHUT(XSUT)
XSHUT_5: U$19.XSHUT(XSUT)
XSHUT_6: U$20.XSHUT(XSUT)
XSHUT_7: U$27.XSHUT(XSUT)
XSHUT_8: U$29.XSHUT(XSUT)
XXX: IC1.1(GPB4)
Unconnected: DIODE.1 DIODE.2 IC1.8(SCL) IC1.9(SDA) IC1.11(A0) IC1.12(A1) IC1.13(A2) IC1.14(!RESET) IC1.15(INTB) IC1.16(INTA) IC2.3(EN) IC3.5(!ON!/OFF) J3.1 J3.2 J3.3 J3.4 SW.3(S) U1.5(XSHUT) U1.7(GPIO1) U1.8(DNC) U1.9(SDA) U1.10(SCL) U3.2(PORTC_H:PC13) U3.3(PORTC_H:PC14) U3.4(PORTC_H:PC15) U3.5(PORTD/OSC:PD0/OSC<=) U3.6(PORTD/OSC:PD1/OSC=>) U3.7(RESET:NRST) U3.8(PORTC_L:PC0) U3.9(PORTC_L:PC1) U3.10(PORTC_L:PC2) U3.11(PORTC_L:PC3) U3.14(PORTA_L:PA0) U3.15(PORTA_L:PA1) U3.16(PORTA_L:PA2) U3.17(PORTA_L:PA3) U3.20(PORTA_L:PA4) U3.21(PORTA_L:PA5) U3.22(PORTA_L:PA6) U3.23(PORTA_L:PA7) U3.24(PORTC_L:PC4) U3.25(PORTC_L:PC5) U3.26(PORTB_L:PB0) U3.27(PORTB_L:PB1) U3.28(PORTB_L:PB2) U3.33(PORTB_H:PB12) U3.34(PORTB_H:PB13) U3.35(PORTB_H:PB14) U3.36(PORTB_H:PB15) U3.37(PORTC_L:PC6) U3.38(PORTC_L:PC7) U3.39(PORTC_H:PC8) U3.40(PORTC_H:PC9) U3.41(PORTA_H:PA8) U3.42(PORTA_H:PA9) U3.43(PORTA_H:PA10) U3.44(PORTA_H:PA11) U3.45(PORTA_H:PA12) U3.46(PORTA_H:PA13) U3.49(PORTA_H:PA14) U3.50(PORTA_H:PA15) U3.51(PORTC_H:PC10) U3.52(PORTC_H:PC11) U3.53(PORTC_H:PC12) U3.54(PORTD/OSC:PD2) U3.55(PORTB_L:PB3) U3.56(PORTB_L:PB4) U3.57(PORTB_L:PB5) U3.60(RESET:BOOT0) U3.61(PORTB_H:PB8) U3.62(PORTB_H:PB9) U$21.17-SO2(SO2) U$33.ADDR U$33.AIN_0 U$33.AIN_1 U$33.AIN_2 U$33.AIN_3 U$33.GND U$33.NC U$33.SCL U$33.SDA U$33.VDD U$34.NC@5(NC) U$34.NC@6(NC) U$34.NC@7(NC) U$34.NC@8(NC) U$34.NC@10(NC) U$34.PIO0 U$34.PIO1 U$34.PIO2 U$34.PIO3 U$34.RESETB U$34.UART_CTS U$34.UART_RTS U$39.2(PF0/OSC_IN) U$39.3(PF1/OSC_OUT)

## Notes on the sheet
- SENSOR BOARD
- LEFT SENSOR | RIGHT SENSOR
- MAIN BOARD
- UBER Motor Controller | UBER Motor Controller
- MOSFETS
- LEFT SIDE | RIGHT SIDE
- BLUETOOTCH
- BRIDGE
- GND_A | GND_C
- LEFT SENSORS | RIGHT SENSORS
- INPUT
- 5V -> 3.3V
- 5V -> 3.3V
- 5V -> 3.3V
- 5V -> 3.3V
- 5V -> 3.3V
- 5V -> 3.3V
- OUTPUT
- CONTROLLER
- STM32F103
- GND & VMotor Viasami idzie
- Rezystory I2C powinny byc 
  na plytce nadrzednej
- zmienic procek na lov power np stm32l4
- zmienic procek na lov power np stm32l4
- zmienic procek na lov power np stm32l4
- zmienic procek na lov power np stm32l4
- zmienic procek na lov power np stm32l4
- zmienic procek na lov power np stm32l4
- zmienic procek na lov power np stm32l4
- SWD
- I2C sterownania
- VOLTAGE DIVIDER | LDO
- U1 Power | Osc 8MHz
- Reset
- BATTERY BOARD
- RIGHT SIDE | LEFT SIDE
- STEP DOWN 5V
- STEP DOWN 3.3V
- FLOATING >

## Power pins joined to a net without a drawn wire
AVDD: U1.11(AVDD)
AVDDVCSEL: U1.1(AVDDVCSEL)
AVSSVCSEL: U1.2(AVSSVCSEL)
GND: U1.3(GND) U1.4(GND) U1.6(GND) U1.12(GND)
VBAT: U3.1(AN_POWER:VBAT)
VDD: IC1.5(VDD)
VDD_1: U3.32(POWER:VDD_1)
VDD_2: U3.48(POWER:VDD_2)
VDD_3: U3.64(POWER:VDD_3)
VDD_4: U3.19(POWER:VDD_4)
VDDA: U3.13(AN_POWER:VDDA)
VSS: IC1.6(VSS)
VSS_1: U3.31(POWER:VSS_1)
VSS_2: U3.47(POWER:VSS_2)
VSS_3: U3.63(POWER:VSS_3)
VSS_4: U3.18(POWER:VSS_4)
VSSA: U3.12(AN_POWER:VSSA)

## Library data of the parts
0001-0009 0010-0033 R1 R2 R12 R13 R16 R24 = resistor:R-EU_: RESISTOR, European symbol
C1-C3 C5 C6 C13 C14 C18 C21 C22 C24 C25 C27-C29 C31 C32 C34-C36 C38 C39 C42 C44-C47 C49 = rcl:C-EU: CAPACITOR, European symbol; SPICEPREFIX: C
C4 C7-C12 C15-C17 C19 C20 C23 C26 C30 C33 = rcl:CPOL-EU: POLARIZED CAPACITOR, European symbol; SPICEPREFIX: C
D1 = diode:SCHOTTKY-DIODE: Schottky Diode
DIODE = rcl:R-EU_: RESISTOR, European symbol; SPICEPREFIX: R
IC1 = MCP:MCP23017: http://ww1.microchip.com/downloads/en/DeviceDoc/21952a.pdf Source: http://ww1.microchip.com/downloads/en/DeviceDoc/21952a.pdf
IC2 = tps709xx_10:TPS709*: TPS709xx 150-mA, 30-V, 1-μA IQ Voltage Regulators with Enable Source: http://www.ti.com/lit/ds/symlink/tps709.pdf; MF: Texas Instruments; MPN: TPS70933DBVT; OC_FARNELL: 2382995; OC_NEWARK: 37X8895
IC3 = national-semiconductor:LM2596: SIMPLE SWITCHER® Power Converter 150 kHz 3A Step-Down Voltage Regulator Source: http://www.national.com/ds/LM/LM2596.pdf; MF: NATIONAL SEMICONDUCTOR; MPN: LM2596S-ADJ/NOPB; OC_FARNELL: 9494367; OC_NEWARK: 41K3842
IC4 = allegro-2:ACS758*: Thermally Enhanced, Fully Integrated, Hall Effect-Based Linear Current Sensor with 100 micro Ohm Current Conductor display layer 49 Reference in BRD and place VIAs on circles Source: http://www.allegromicro.com/en/Products/Part_Numbers/0758/0758.pdf; MPN: ACS758ECB-200B-PFF-T; OC_FARNELL: 1718993; OC_NEWARK: 04R7127
J1 J3 = SparkFun-Connectors:CONN_04: Multi connection point. Often used as Generic Header-pin footprint for 0.1 inch spaced/style header connections On any of the 0.1 inch spaced packages, you can populate with these: Break Away Headers - Straight <https://www.sparkfun.com/products/116> (PRT-00116) Break Away Male Headers - Right Angle <https://www.sparkfun.com/products/553> (PRT-00553) Female Headers <https://www.sparkfun.com/products/115> (PRT-00115) Break Away Headers - Machine Pin <https://www.sparkfun.com/products/117> (PRT-00117) Break Away Female Headers - Swiss Machine Pin <https://www.sparkfun.com/products/743> (PRT-00743) For SCREWTERMINALS and SPRING TERMINALS visit here: Screw Terimnals on SparkFun.com <https://www.sparkfun.com/search/results?term=Screw+Terminals> (5mm/3.5mm/2.54mm spacing) This device is also useful as a general connection point to wire up your design to another part of your project. Our various solder wires solder well into these plated through hole pads. Hook-Up Wire - Assortment (Stranded, 22 AWG) <https://www.sparkfun.com/products/11375> (PRT-11375) Hook-Up Wire - Assortment (Solid Core, 22 AWG) <https://www.sparkfun.com/products/11367> (PRT-11367) View the entire wire category on our website here <https://www.sparkfun.com/categories/141> Special notes: Molex polarized connector foot print use with SKU : PRT-08231 with associated crimp pins and housings. 1MM SMD Version SKU: PRT-10208; PROD_ID: CONN-09696
J4 = SparkFun-Connectors:CONN_05: Multi connection point. Often used as Generic Header-pin footprint for 0.1 inch spaced/style header connections On any of the 0.1 inch spaced packages, you can populate with these: Break Away Headers - Straight <https://www.sparkfun.com/products/116> (PRT-00116) Break Away Male Headers - Right Angle <https://www.sparkfun.com/products/553> (PRT-00553) Female Headers <https://www.sparkfun.com/products/115> (PRT-00115) Break Away Headers - Machine Pin <https://www.sparkfun.com/products/117> (PRT-00117) Break Away Female Headers - Swiss Machine Pin <https://www.sparkfun.com/products/743> (PRT-00743) For SCREWTERMINALS and SPRING TERMINALS visit here: Screw Terimnals on SparkFun.com <https://www.sparkfun.com/search/results?term=Screw+Terminals> (5mm/3.5mm/2.54mm spacing) This device is also useful as a general connection point to wire up your design to another part of your project. Our various solder wires solder well into these plated through hole pads. Hook-Up Wire - Assortment (Stranded, 22 AWG) <https://www.sparkfun.com/products/11375> (PRT-11375) Hook-Up Wire - Assortment (Solid Core, 22 AWG) <https://www.sparkfun.com/products/11367> (PRT-11367) View the entire wire category on our website here <https://www.sparkfun.com/categories/141> Special notes: Molex polarized connector foot print use with SKU : PRT-08231 with associated crimp pins and housings. 1MM SMD Version SKU: PRT-10208
L2 = inductor-sumida:CDRH127/LD: Power Inductor
L4 = SparkFun-Coils:INDUCTOR: Inductors Resist changes in electrical current. Basically a coil of wire. SparkFun Products: SparkFun Load Cell Amplifier - HX711 <https://www.sparkfun.com/products/13879> IOIO-OTG - V2.2 <https://www.sparkfun.com/products/13613>; PROD_ID: NDUC-11627; VALUE: 33µH/±20%/1.4A
LED1-LED3 LED9 = led:LED: LED OSRAM: - CHIPLED LG R971, LG N971, LY N971, LG Q971, LY Q971, LO R971, LY R971 LH N974, LH R974 LS Q976, LO Q976, LY Q976 LO Q996 - Hyper CHIPLED LW Q18S LB Q993, LB Q99A, LB R99A - SideLED LS A670, LO A670, LY A670, LG A670, LP A670 LB A673, LV A673, LT A673, LW A673 LH A674 LY A675 LS A676, LA A676, LO A676, LY A676, LW A676 LS A679, LY A679, LG A679 - Hyper Micro SIDELED® LS Y876, LA Y876, LO Y876, LY Y876 LT Y87S - SmartLED LW L88C, LW L88S LB L89C, LB L89S, LG L890 LS L89K, LO L89K, LY L89K LS L896, LA L896, LO L896, LY L896 - TOPLED LS T670, LO T670, LY T670, LG T670, LP T670 LSG T670, LSP T670, LSY T670, LOP T670, LYG T670 LG T671, LOG T671, LSG T671 LB T673, LV T673, LT T673, LW T673 LH T674 LS T676, LA T676, LO T676, LY T676, LB T676, LH T676, LSB T676, LW T676 LB T67C, LV T67C, LT T67C, LS T67K, LO T67K, LY T67K, LW E67C LS E67B, LA E67B, LO E67B, LY E67B, LB E67C, LV E67C, LT E67C LW T67C LS T679, LY T679, LG T679 LS T770, LO T770, LY T770, LG T770, LP T770 LB T773, LV T773, LT T773, LW T773 LH T774 LS E675, LA E675, LY E675, LS T675 LS T776, LA T776, LO T776, LY T776, LB T776 LHGB T686 LT T68C, LB T68C - Hyper Mini TOPLED® LB M676 - Mini TOPLED Santana® LG M470 LS M47K, LO M47K, LY M47K Source: http://www.osram.convergy.de LUXEON: - LUMILED® LXK2-PW12-R00, LXK2-PW12-S00, LXK2-PW14-U00, LXK2-PW14-V00 LXK2-PM12-R00, LXK2-PM12-S00, LXK2-PM14-U00 LXK2-PE12-Q00, LXK2-PE12-R00, LXK2-PE12-S00, LXK2-PE14-T00, LXK2-PE14-U00 LXK2-PB12-K00, LXK2-PB12-L00, LXK2-PB12-M00, LXK2-PB14-N00, LXK2-PB14-P00, LXK2-PB14-Q00 LXK2-PR12-L00, LXK2-PR12-M00, LXK2-PR14-Q00, LXK2-PR14-R00 LXK2-PD12-Q00, LXK2-PD12-R00, LXK2-PD12-S00 LXK2-PH12-R00, LXK2-PH12-S00 LXK2-PL12-P00, LXK2-PL12-Q00, LXK2-PL12-R00 Source: www.luxeon.com KINGBRIGHT: KA-3528ASYC Source: www.kingbright.com
M_A M_B MOTOR_PAD_C PAD1-PAD12 = wirepad:SMD5: SMD PAD
ON = SparkFun-Switches:MOMENTARY-SWITCH-SPST: Momentary Switch (Pushbutton) - SPST Normally-open (NO) SPST momentary switches (buttons, pushbuttons). Variants PTH-12MM - 12mm square, through-hole Momentary Pushbutton Switch - 12mm Square <https://www.sparkfun.com/products/9190> (COM-09190) PTH-6.0MM, PTH-6.0MM-KIT - 6.0mm square, through-hole Mini Pushbutton Switch <https://www.sparkfun.com/products/97> (COM-00097) KIT package intended for soldering kit's - only one side of pads' copper is exposed. PTH-RIGHT-ANGLE-KIT - Right-angle, through-hole Right Angle Tactile Button <https://www.sparkfun.com/products/10791> - Used on SparkFun BigTime Watch Kit <https://www.sparkfun.com/products/11734> SMD-12MM - 12mm square, surface-mount Tactile Button - SMD (12mm) <https://www.sparkfun.com/products/12993> (COM-12993) Used on SparkFun PicoBoard <https://www.sparkfun.com/products/11888> SMD-4.5MM - 4.5mm Square Trackball Switch Used on SparkFun Blackberry Trackballer Breakout <https://www.sparkfun.com/products/13169> SMD-4.6MMX2.8MM - 4.60mm x 2.80mm, surface mount Used on SparkFun SAMD21 Mini Breakout <https://www.sparkfun.com/products/13664> SMD-5.2MM, SMD-5.2-REDUNDANT - 5.2mm square, surface-mount Mini Pushbutton Switch - SMD <https://www.sparkfun.com/products/8720> (COM-08720) Used on Arduino Pro Mini <https://www.sparkfun.com/products/11114> REDUNDANT package connects both switch circuits together SMD-6.0X3.5MM - 6.0 x 3.5mm, surface mount Momentary Reset Switch SMD <https://www.sparkfun.com/products/8229> (COM-08229) SMD-6.2MM-TALL - 6.2mm square, surface mount Tactile Button - SMD (6mm) <https://www.sparkfun.com/products/12992> Used on SparkFun Digital Sandbox <https://www.sparkfun.com/products/12651> SMD-RIGHT-ANGLE - Right-angle, surface mount Used on SparkFun Block for Intel® Edison - Arduino <https://www.sparkfun.com/products/13036>; PROD_ID: COMP-12265
SW = SparkFun-Switches:SWITCH-SPDT: Single Pole, Double Throw (SPDT) Switch Single-pole, double-throw (SPDT) switch. Variant Overview SMD-AYZ0202 Surface Mount DPDT Switch <https://www.sparkfun.com/products/597> (COM-00597) Used on e.g. LilyPad Arduino USB - ATmega32U4 Board <https://www.sparkfun.com/products/12049> PTH-11.6X4.0MM SPDT Mini Power Switch <https://www.sparkfun.com/products/102> (COM-00102) Used on e.g. SparkFun Simon Says - Through-Hole Soldering Kit <https://www.sparkfun.com/products/10547> (KIT-10547) PTH-11.6X4.0MM-KIT KIT version of SPDT Mini Power Switch - Simplifies soldering by removing tStop of switch pins - only one side can be soldered. PTH-11.6X4.0MM-LOCK LOCK version of SPDT Mini Power Switch - Offset pins hold switch in place for easier soldering. SMD-RIGHT-ANGLE Surface Mount Right Angle Switch <https://www.sparkfun.com/products/10860> (COM-10860) Used on e.g. SparkFun ESP8266 Thing <https://www.sparkfun.com/products/13231>; PROD_ID: SWCH-10651; SF_SKU: COM-10860
T1 = transistor:*-NPN-: NPN Transistror BF959 corrected 2008.03.06
T2 = transistor:*-PNP-: PNP Transistror
U1 = microbuilder:VL53L0X: VL53L0X - Laser Time of Flight Sensor (2M range)
U2 = stm32:STM32F10XTXU6: STM32F101/103 36pad VFQPFN36
U3 = stm32:STM32F10XRXT6: STM32F101/103 64pin LQFP
U$1 U$2 U$4 U$5 U$9 = MOLEX:MOLEG_REC_8X0.4MM
U$3 U$6-U$8 = MOLEX:MOLEX_PLUG_8X0.4MM
U$10 = OSC_8MHZ:OSC_8MHZ
U$11 = Zestaw:TLV760XX
U$12 U$13 U$22-U$26 U$28 = CSD_Mosfet:CSD17573Q5B
U$14-U$16 U$18 = TOF+SHARP:TOF+SHARP
U$17 U$36-U$38 = XT60:XT60: XT60
U$19 U$20 U$27 U$29 = TOF+SHARP:TOF-SHARP
U$21 = drv8305lbr:DRV8305
U$30 = SuperDuperGuziczek:SUPER_DUPER_GUZICZEK
U$31 = tpd4e001:TPD4E001
U$32 = IR_SW:IR_SW
U$33 = TLA2024:TLA2024
U$34 = hm-11:HM-11: JNHuaMao HM-11 Bluetooth 4.0 Transceiver based on TI CC2540/CC2541
U$35 = MP2307:MP2307
U$39 = STM32L0:STM32F030F4